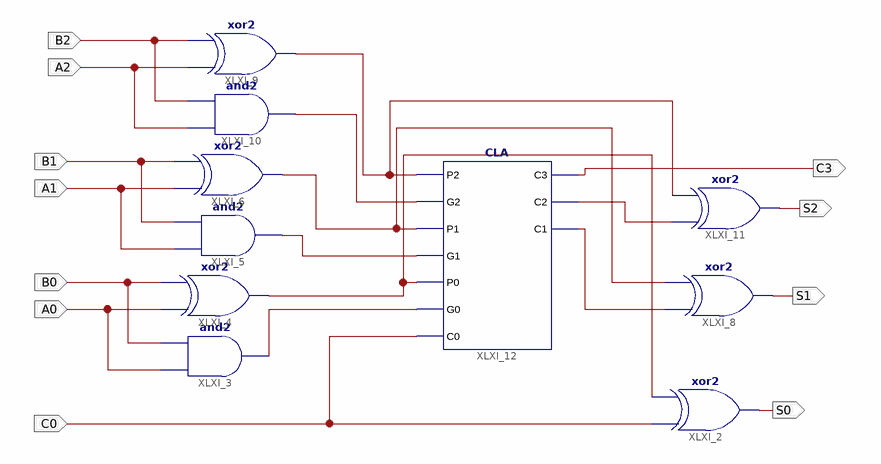
[diagram p0: schematic sheet 1]
// Xilinx ISE schematic CLA3.sch (spartan3e) as structural Verilog: 10 symbols, 11 ports
module CLA3 (
  input  C0,
  input  B0,
  input  A0,
  input  B1,
  input  A1,
  input  B2,
  input  A2,
  output S0,
  output S1,
  output S2,
  output C3
);

  wire XLXN_3, XLXN_13, XLXN_17, XLXN_18, XLXN_21, XLXN_24, XLXN_25, XLXN_33;

  xor XLXI_2 (S0, C0, XLXN_13);
  and XLXI_3 (XLXN_3, A0, B0);
  xor XLXI_4 (XLXN_13, A0, B0);
  and XLXI_5 (XLXN_17, A1, B1);
  xor XLXI_6 (XLXN_18, A1, B1);
  xor XLXI_8 (S1, XLXN_21, XLXN_18);
  xor XLXI_9 (XLXN_25, A2, B2);
  and XLXI_10 (XLXN_24, A2, B2);
  xor XLXI_11 (S2, XLXN_33, XLXN_25);
  CLA XLXI_12 (
    .C0(C0), .C1(XLXN_21), .C2(XLXN_33), .C3(C3), .G0(XLXN_3), .G1(XLXN_17), .G2(XLXN_24), .P0(XLXN_13),
    .P1(XLXN_18), .P2(XLXN_25));
endmodule
